# Altium schematic sheet Gas sensor.SchDoc
size A4; SheetNumber: 4; SheetTotal: 6
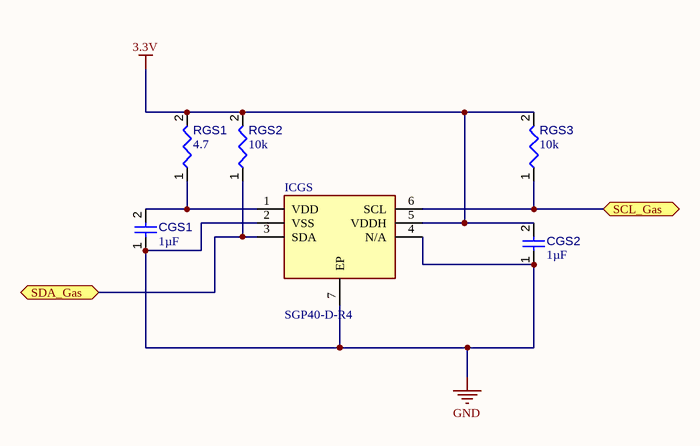
[diagram p0: Gas sensor.SchDoc]

## Parts
CGS1  value 1µF  [CAPC1005X55X25ML5T10]  (hidden comment: Capacitor 1 uF +/- 10% 6.3 V 1005)
CGS2  value 1µF  [CAPC1005X55X25ML5T10]  (hidden comment: Capacitor 1 uF +/- 10% 6.3 V 1005)
ICGS  SGP40-D-R4  [SON80P244X244X95-7N]
RGS1  value 4.7  [RESC0805(2012)_L]  (hidden comment: Resistor 4R7  +/-5 % 0805 125 mW)
RGS2  value 10k  [RESC0402(1005)_L]  (hidden comment: Resistor 10K  +/-1 % 0402 63 mW)
RGS3  value 10k  [RESC0402(1005)_L]  (hidden comment: Resistor 10K  +/-1 % 0402 63 mW)

## Ports
SCL_Gas (bidir), SDA_Gas (bidir)

## Nets
3.3V: CGS2.2 ICGS.5(VDDH) RGS1.2 RGS2.2 RGS3.2
GND: CGS1.1 CGS2.1 ICGS.2(VSS) ICGS.4(N/A) ICGS.7(EP)
SCL_Gas: ICGS.6(SCL) RGS3.1 ; port SCL_Gas
SDA_Gas: ICGS.3(SDA) RGS2.1 ; port SDA_Gas
NetCGS1_2: CGS1.2 ICGS.1(VDD) RGS1.1

## Library data of the parts
CGS1 CGS2 = CMP-001-00009-6: Chip Capacitor, 1 uF, +/- 10%, 6.3 V, 1005 (0402 Metric); Voltage Rating: 6.3V; Capacitor Type: Ceramic; Min Operating Temperature: -55°C; Case/Package: 0402; Tolerance: 10%; Mounting Technology: SM; Max Operating Temperature: 85°C; RoHS Compliant: True; Pins: 2
ICGS = SGP40-D-R4: Integrated Circuit; Manufacturer_Name: Sensirion; Datasheet Link: https://www.mouser.com/datasheet/2/682/Sensirion_Gas_Sensors_SGP40_Datasheet-1888696.pdf; Height: 0.95mm; Manufacturer_Part_Number: SGP40-D-R4; Mouser Part Number: 403-SGP40-D-R4; Mouser Price/Stock: https://www.mouser.co.uk/ProductDetail/Sensirion/SGP40-D-R4?qs=yqaQSyyJnNgaRqiZfsbS1Q%3D%3D; Arrow Part Number: SGP40-D-R4; Arrow Price/Stock: https://www.arrow.com/en/products/sgp40-d-r4/sensirion-ag?region=nac
RGS1 = CMP-009-00174-3: Chip Resistor, 4,7 Ohms, +/-5 %, 125 mW, -55 to 155 degC, 0805; Tolerance: 5%; Power: 125mW; Max Operating Temperature: 155°C; Case/Package: 0805; Min Operating Temperature: -55°C; Pins: 2
RGS2 RGS3 = CMP-009-00149-3: Chip Resistor, 10 kOhms, +/-1 %, 63 mW, -55 to 125 degC, 0402; Power: 63mW; Tolerance: 1%; Min Operating Temperature: -55°C; Case/Package: 0402; Max Operating Temperature: 155°C; Pins: 2